# EAGLE design Level Shifter (EAGLE 5.11)
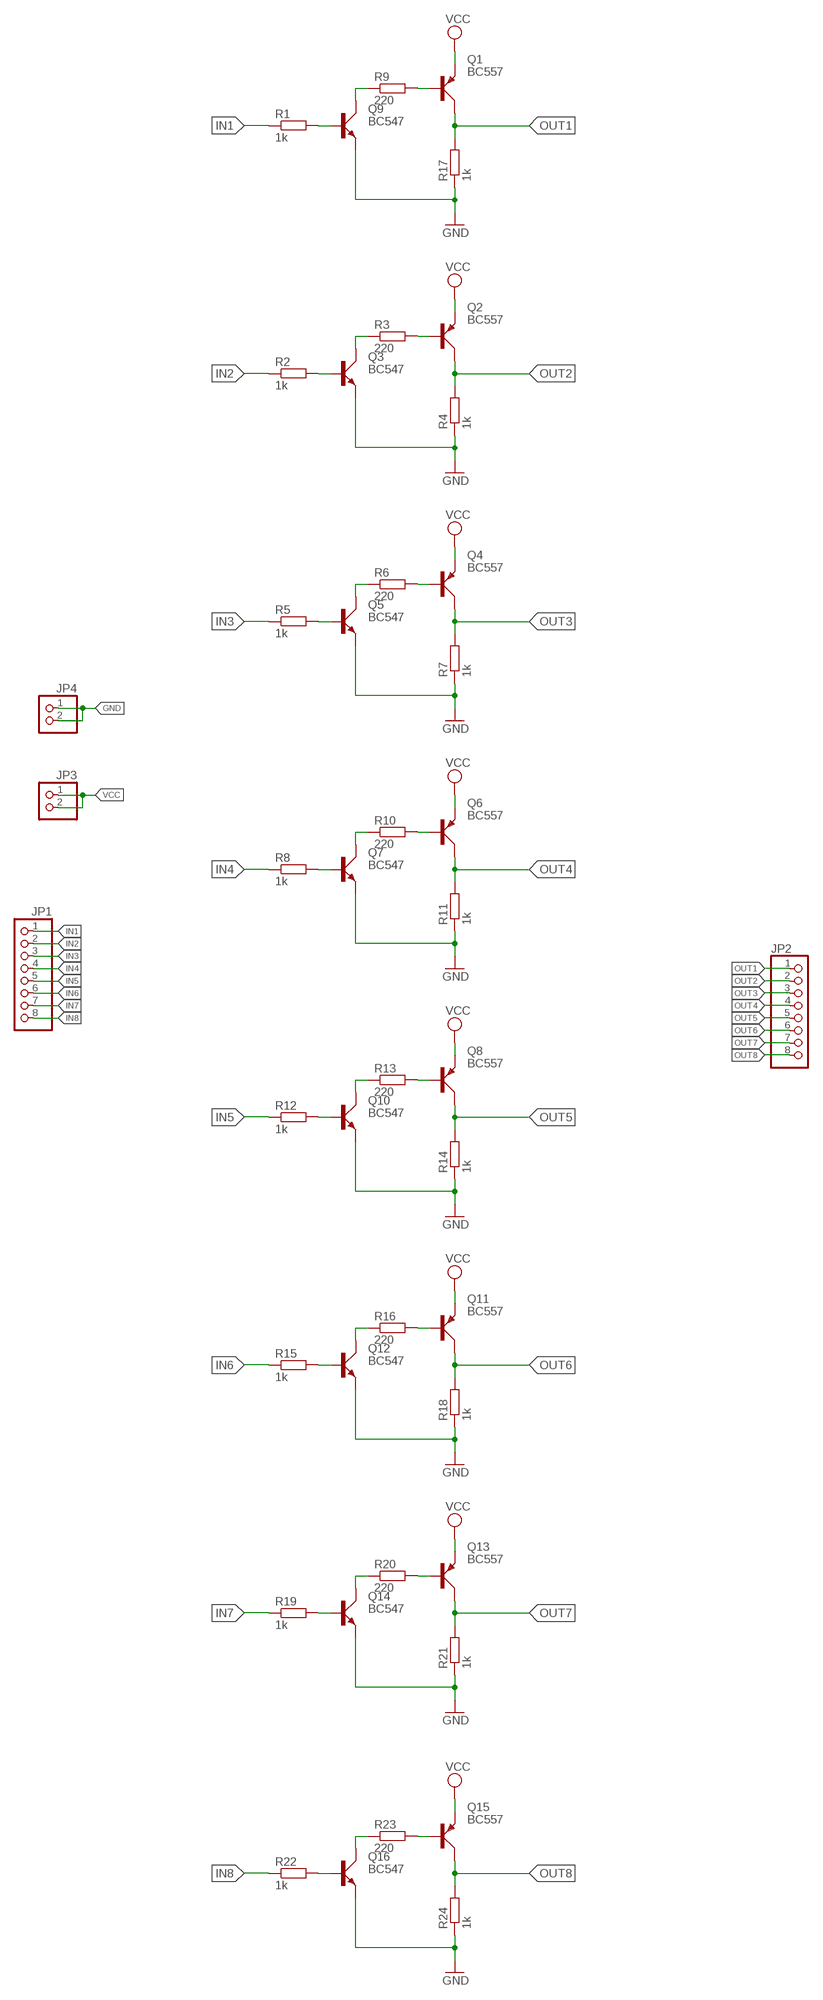
[diagram p0: schematic, sheet 1]

## Parts
JP1  PINHD-1X8  [1X08]
JP2  PINHD-1X8  [1X08]
JP3  PINHD-1X2  [1X02]
JP4  PINHD-1X2  [1X02]
Q1  BC557  [SOT54A]
Q2  BC557  [SOT54A]
Q3  BC547  [SOT54A]
Q4  BC557  [SOT54A]
Q5  BC547  [SOT54A]
Q6  BC557  [SOT54A]
Q7  BC547  [SOT54A]
Q8  BC557  [SOT54A]
Q9  BC547  [SOT54A]
Q10  BC547  [SOT54A]
Q11  BC557  [SOT54A]
Q12  BC547  [SOT54A]
Q13  BC557  [SOT54A]
Q14  BC547  [SOT54A]
Q15  BC557  [SOT54A]
Q16  BC547  [SOT54A]
R1  1k  R-EU_0207/10  [0207/10]
R2  1k  R-EU_0207/10  [0207/10]
R3  220  R-EU_0207/10  [0207/10]
R4  1k  R-EU_0207/10  [0207/10]
R5  1k  R-EU_0207/10  [0207/10]
R6  220  R-EU_0207/10  [0207/10]
R7  1k  R-EU_0207/10  [0207/10]
R8  1k  R-EU_0207/10  [0207/10]
R9  220  R-EU_0207/10  [0207/10]
R10  220  R-EU_0207/10  [0207/10]
R11  1k  R-EU_0207/10  [0207/10]
R12  1k  R-EU_0207/10  [0207/10]
R13  220  R-EU_0207/10  [0207/10]
R14  1k  R-EU_0207/10  [0207/10]
R15  1k  R-EU_0207/10  [0207/10]
R16  220  R-EU_0207/10  [0207/10]
R17  1k  R-EU_0207/10  [0207/10]
R18  1k  R-EU_0207/10  [0207/10]
R19  1k  R-EU_0207/10  [0207/10]
R20  220  R-EU_0207/10  [0207/10]
R21  1k  R-EU_0207/10  [0207/10]
R22  1k  R-EU_0207/10  [0207/10]
R23  220  R-EU_0207/10  [0207/10]
R24  1k  R-EU_0207/10  [0207/10]

## Nets
GND: JP4.1 JP4.2 Q3.E Q5.E Q7.E Q9.E Q10.E Q12.E Q14.E Q16.E R4.1 R7.1 R11.1 R14.1 R17.1 R18.1 R21.1 R24.1
IN1: JP1.1 R1.1
IN2: JP1.2 R2.1
IN3: JP1.3 R5.1
IN4: JP1.4 R8.1
IN5: JP1.5 R12.1
IN6: JP1.6 R15.1
IN7: JP1.7 R19.1
IN8: JP1.8 R22.1
N$1: Q9.B R1.2
N$2: Q9.C R9.1
N$3: Q1.B R9.2
N$6: Q3.B R2.2
N$7: Q3.C R3.1
N$8: Q2.B R3.2
N$11: Q5.B R5.2
N$12: Q5.C R6.1
N$13: Q4.B R6.2
N$16: Q7.B R8.2
N$17: Q7.C R10.1
N$18: Q6.B R10.2
N$21: Q10.B R12.2
N$22: Q10.C R13.1
N$23: Q8.B R13.2
N$26: Q12.B R15.2
N$27: Q12.C R16.1
N$28: Q11.B R16.2
N$31: Q14.B R19.2
N$32: Q14.C R20.1
N$33: Q13.B R20.2
N$36: Q16.B R22.2
N$37: Q16.C R23.1
N$38: Q15.B R23.2
OUT1: JP2.1 Q1.C R17.2
OUT2: JP2.2 Q2.C R4.2
OUT3: JP2.3 Q4.C R7.2
OUT4: JP2.4 Q6.C R11.2
OUT5: JP2.5 Q8.C R14.2
OUT6: JP2.6 Q11.C R18.2
OUT7: JP2.7 Q13.C R21.2
OUT8: JP2.8 Q15.C R24.2
VCC: JP3.1 JP3.2 Q1.E Q2.E Q4.E Q6.E Q8.E Q11.E Q13.E Q15.E

## Library data of the parts
JP1 JP2 = pinhead:PINHD-1X8: PIN HEADER
JP3 JP4 = pinhead:PINHD-1X2: PIN HEADER
Q1 Q2 Q4 Q6 Q8 Q11 Q13 Q15 = transistor-small-signal:BC557: PNP TRANSISTOR
Q3 Q5 Q7 Q9 Q10 Q12 Q14 Q16 = transistor-small-signal:BC547: NPN TRANSISTOR
R1-R24 = rcl:R-EU_: RESISTOR, European symbol

## Board
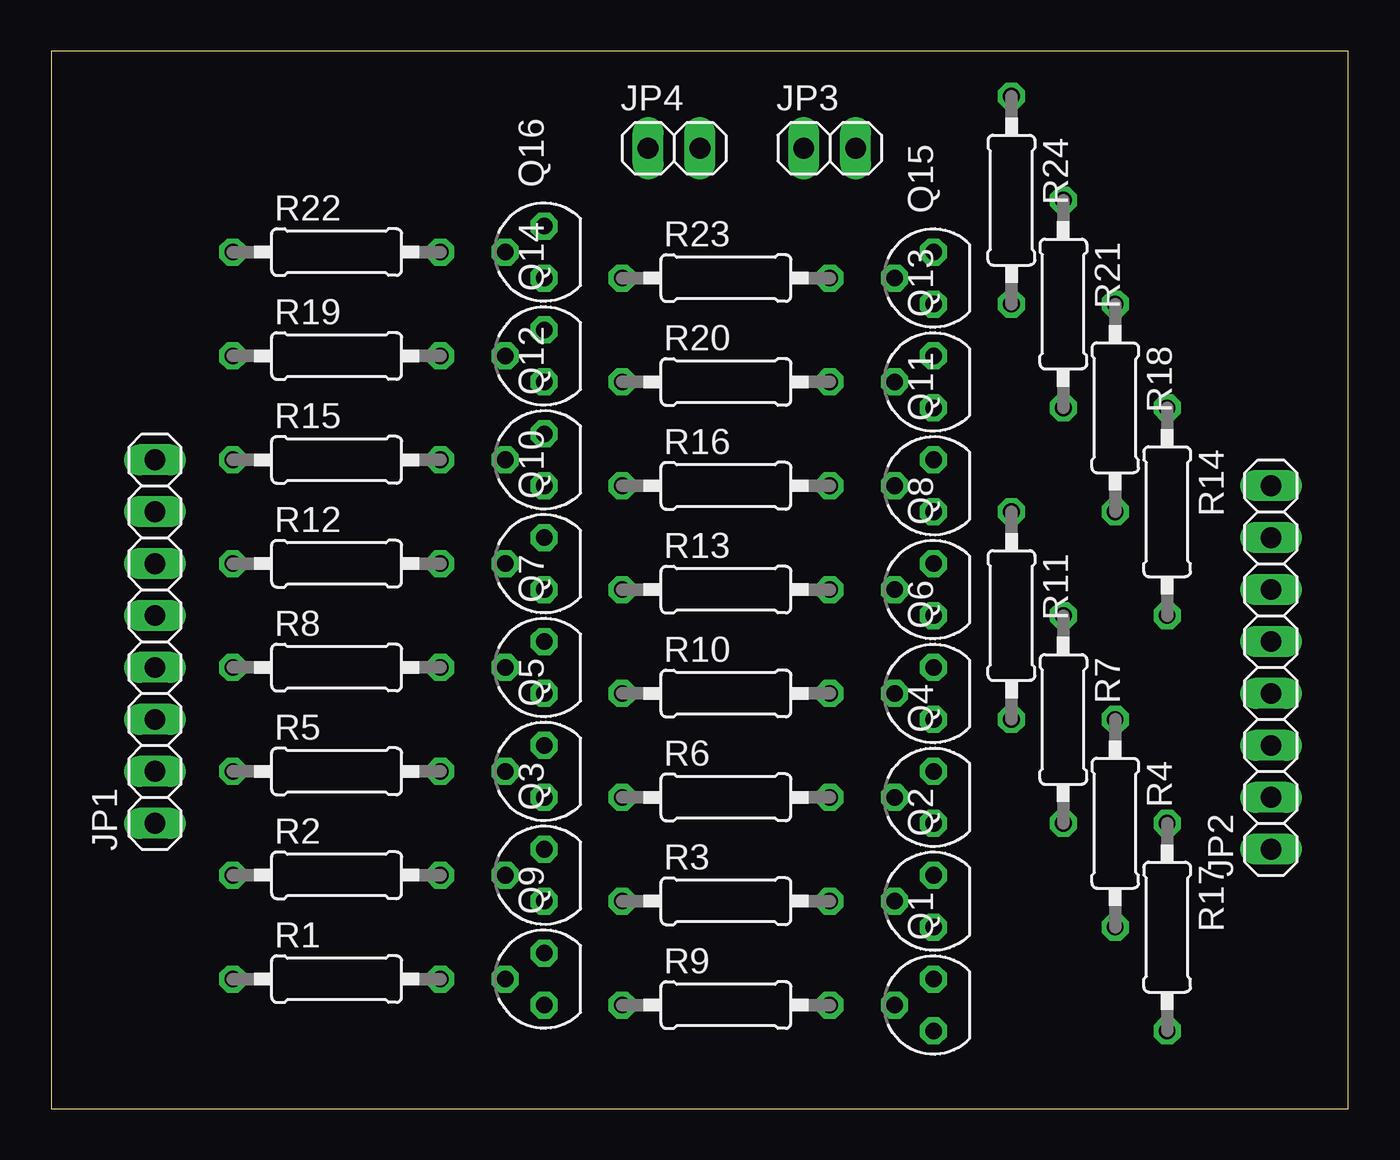
[diagram p1: board, top side]
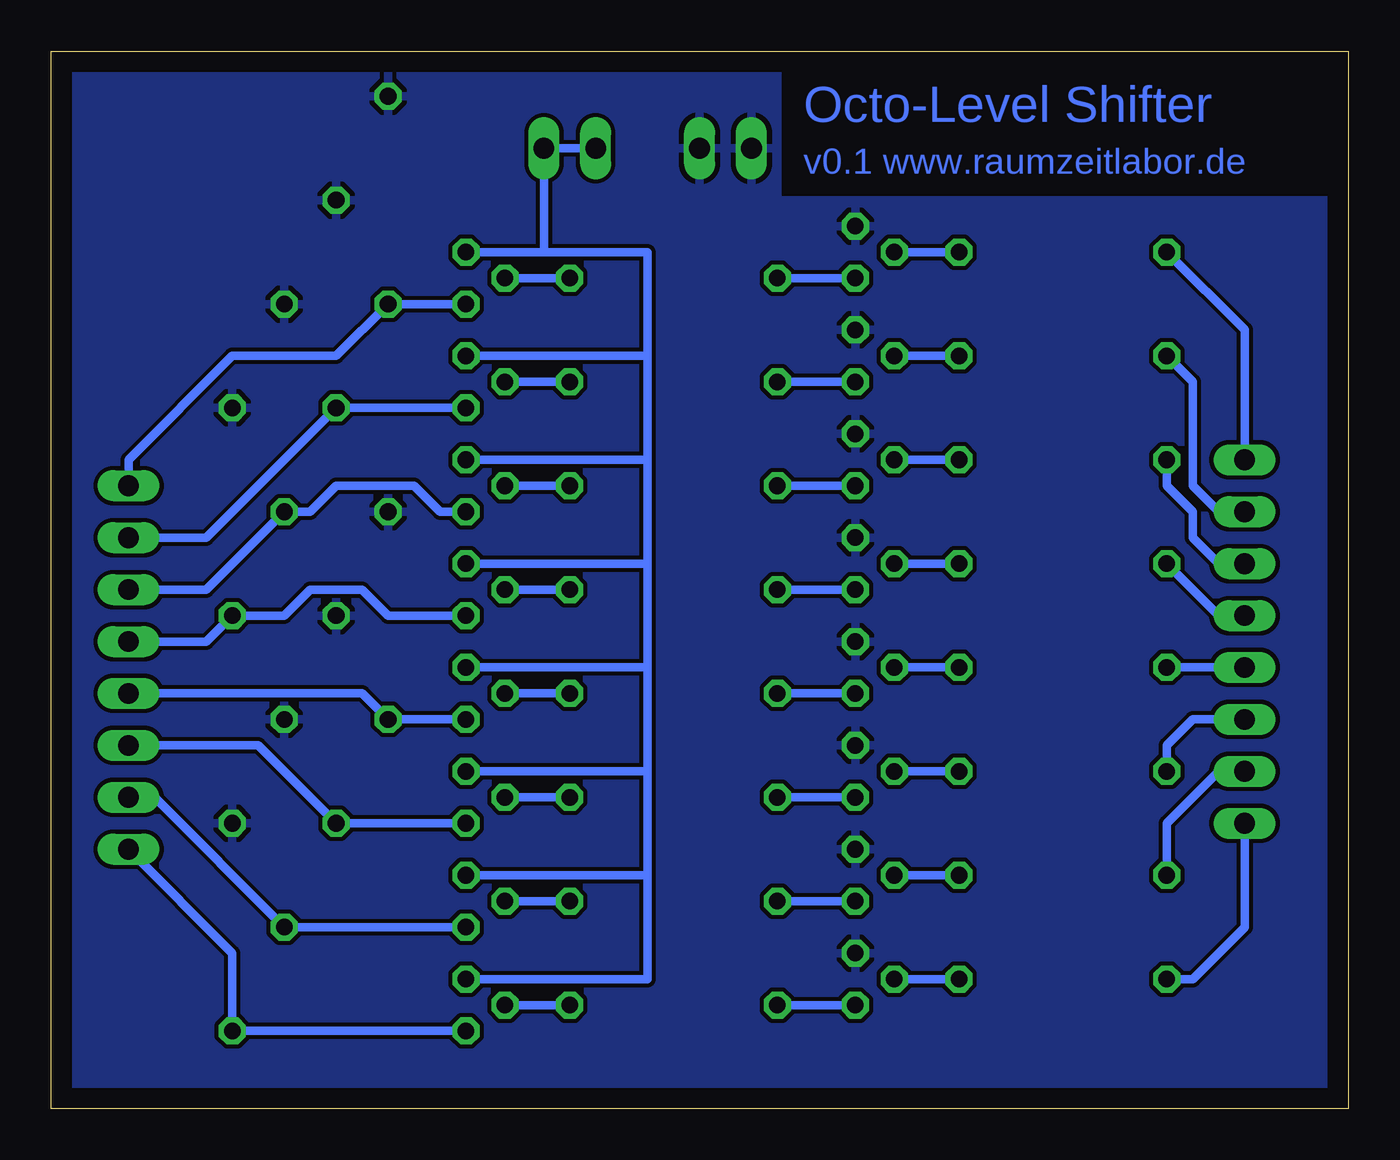
[diagram p2: board, bottom side, seen from below]

Size 63.48 x 51.74 mm. Coordinates in mm from the lower left corner, seen from the top.
Outline: 0,0 63.48,0 63.48,51.74 0,51.74 0,0
Copper layers (1*16): Top 0.035mm / dielectric 1.5mm / Bottom 0.035mm
Design rules "default *": minimum track width 10mil, minimum drill 24mil, track to track 8mil, track to pad 8mil, pad to pad 8mil, via to via 8mil, smd to smd 8mil, copper to edge 40mil, drill to drill 8mil, minimum pad ring 10mil, minimum via ring 8mil, stop-mask expansion 4mil, vias tented up to drill 0mil, thermal gap 10mil

### Footprints (pad centres in the part's own frame; a part is rotated, then mirrored left to right if it is on the bottom)
1X08 = drill 1.016 long: 1 -8.89,0; 2 -6.35,0; 3 -3.81,0; 4 -1.27,0; 5 1.27,0; 6 3.81,0; 7 6.35,0; 8 8.89,0
1X02 = drill 1.016 long: 1 -1.27,0; 2 1.27,0
SOT54A = drill 0.813 octagon: B 0,1.905; C -1.27,0; E 1.27,0
0207/10 = drill 0.813 octagon: 1 -5.08,0; 2 5.08,0

### Placement (x,y rotation side)
JP1  5.08,22.86 90 top
JP2  59.69,21.59 90 top
JP3  38.1,46.99 0 top
JP4  30.48,46.99 0 top
Q1  43.18,5.08 90 top
Q2  43.18,10.16 90 top
Q3  24.13,11.43 90 top
Q4  43.18,15.24 90 top
Q5  24.13,16.51 90 top
Q6  43.18,20.32 90 top
Q7  24.13,21.59 90 top
Q8  43.18,25.4 90 top
Q9  24.13,6.35 90 top
Q10  24.13,26.67 90 top
Q11  43.18,30.48 90 top
Q12  24.13,31.75 90 top
Q13  43.18,35.56 90 top
Q14  24.13,36.83 90 top
Q15  43.18,40.64 90 top
Q16  24.13,41.91 90 top
R1  13.97,6.35 0 top
R2  13.97,11.43 0 top
R3  33.02,10.16 0 top
R4  52.07,13.97 270 top
R5  13.97,16.51 0 top
R6  33.02,15.24 0 top
R7  49.53,19.05 270 top
R8  13.97,21.59 0 top
R9  33.02,5.08 0 top
R10  33.02,20.32 0 top
R11  46.99,24.13 270 top
R12  13.97,26.67 0 top
R13  33.02,25.4 0 top
R14  54.61,29.21 270 top
R15  13.97,31.75 0 top
R16  33.02,30.48 0 top
R17  54.61,8.89 270 top
R18  52.07,34.29 270 top
R19  13.97,36.83 0 top
R20  33.02,35.56 0 top
R21  49.53,39.37 270 top
R22  13.97,41.91 0 top
R23  33.02,40.64 0 top
R24  46.99,44.45 270 top

### Tracks (layer width: path | path; a pad name or v marks a point on that pad's centre or on a via)
GND
  pour Bottom: 0,44.45 27.94,44.45 27.94,52.07 63.5,52.07 63.5,0 0,0
IN1
  Bottom 0.406: R1.1 7.62,6.35 5.08,8.89 JP1.1
IN2
  Bottom 0.406: R2.1 8.89,13.97 6.35,16.51 JP1.2
IN3
  Bottom 0.406: JP1.3 7.62,19.05 8.89,17.78 R5.1
IN4
  Bottom 0.406: JP1.4 R8.1
IN5
  Bottom 0.406: JP1.5 6.35,24.13 R12.1
IN6
  Bottom 0.406: JP1.6 6.35,26.67 7.62,27.94 7.62,29.21 8.89,30.48 R15.1
IN7
  Bottom 0.406: R19.1 7.62,35.56 7.62,30.48 6.35,29.21 JP1.7
IN8
  Bottom 0.406: JP1.8 5.08,38.1 R22.1
N$1
  Bottom 0.406: R1.2 Q9.B
N$2
  Bottom 0.406: Q9.C R9.1
N$3
  Bottom 0.406: R9.2 Q1.B
N$6
  Bottom 0.406: R2.2 Q3.B
N$7
  Bottom 0.406: Q3.C R3.1
N$8
  Bottom 0.406: R3.2 Q2.B
N$11
  Bottom 0.406: R5.2 Q5.B
N$12
  Bottom 0.406: Q5.C R6.1
N$13
  Bottom 0.406: R6.2 Q4.B
N$16
  Bottom 0.406: R8.2 Q7.B
N$17
  Bottom 0.406: Q7.C R10.1
N$18
  Bottom 0.406: R10.2 Q6.B
N$21
  Bottom 0.406: R12.2 Q10.B
N$22
  Bottom 0.406: Q10.C R13.1
N$23
  Bottom 0.406: R13.2 Q8.B
N$26
  Bottom 0.406: R15.2 Q12.B
N$27
  Bottom 0.406: Q12.C R16.1
N$28
  Bottom 0.406: R16.2 Q11.B
N$31
  Bottom 0.406: R19.2 Q14.B
N$32
  Bottom 0.406: Q14.C R20.1
N$33
  Bottom 0.406: R20.2 Q13.B
N$36
  Bottom 0.406: R22.2 Q16.B
N$37
  Bottom 0.406: Q16.C R23.1
N$38
  Bottom 0.406: R23.2 Q15.B
OUT1
  Bottom 0.406: JP2.1 54.61,7.62 R17.2 Q1.C
OUT2
  Bottom 0.406: Q2.C R4.2 58.42,15.24 JP2.2
OUT3
  Bottom 0.406: Q4.C R7.2 53.34,17.78 JP2.3
OUT4
  Bottom 0.406: JP2.4 48.26,20.32 R11.2 Q6.C
OUT5
  Bottom 0.406: JP2.5 55.88,22.86 R14.2 52.07,24.13 50.8,25.4 48.26,25.4 46.99,24.13 Q8.C
OUT6
  Bottom 0.406: Q11.C 44.45,29.21 45.72,30.48 49.53,30.48 50.8,29.21 R18.2 55.88,25.4 JP2.6
OUT7
  Bottom 0.406: Q13.C R21.2 55.88,27.94 JP2.7
OUT8
  Bottom 0.406: Q15.C R24.2 49.53,36.83 54.61,36.83 59.69,31.75 JP2.8
VCC
  Bottom 0.406: 39.37,41.91 JP3.2 JP3.1 | 39.37,41.91 Q15.E | 39.37,41.91 34.29,41.91 34.29,36.83 | 34.29,11.43 34.29,6.35 Q1.E | 34.29,11.43 34.29,16.51 | 34.29,16.51 34.29,21.59 | 34.29,21.59 34.29,26.67 | 34.29,26.67 34.29,31.75 | 34.29,31.75 34.29,36.83 | 34.29,11.43 Q2.E | 34.29,16.51 Q4.E | 34.29,21.59 Q6.E | 34.29,26.67 Q8.E | 34.29,31.75 Q11.E | 34.29,36.83 Q13.E

### Text on the board
Bottom: Octo-Level Shifter | v0.1 www.raumzeitlabor.de